# EAGLE schematic untitled (EAGLE 9.6.2)
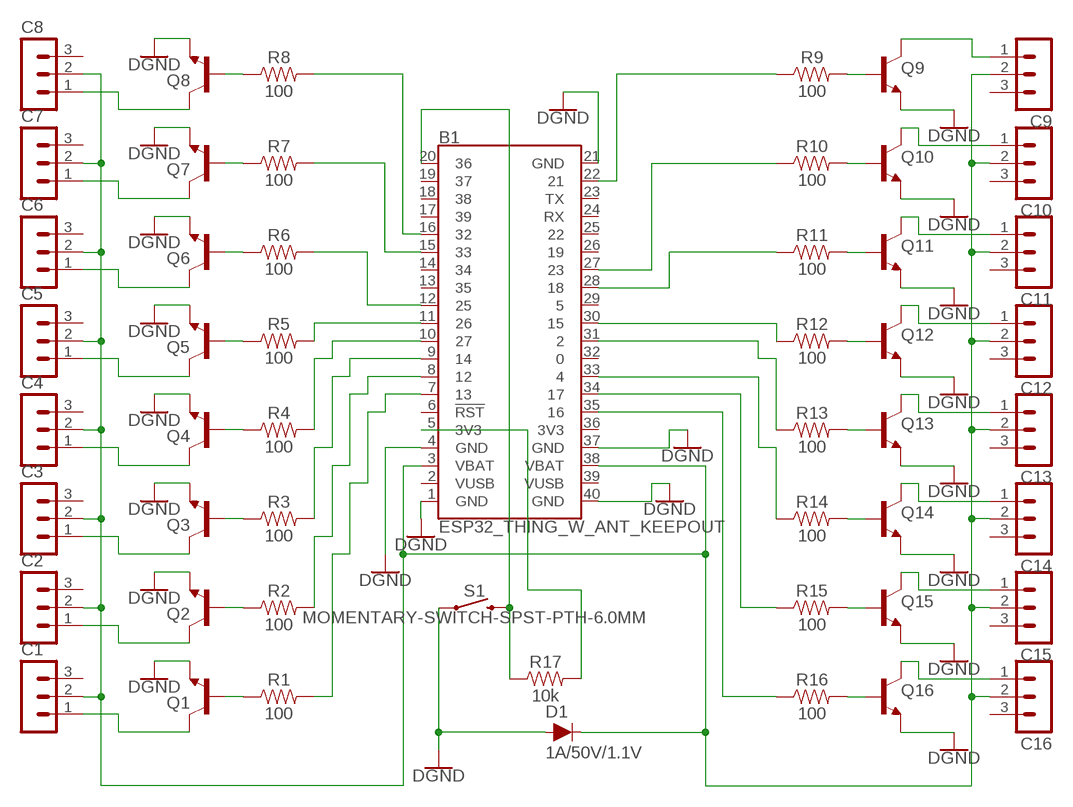
[diagram p0: schematic, sheet 1]

## Parts
B1  ESP32_THING_W_ANT_KEEPOUT  [ESP32_THING]
C1  MA03-1  [MA03-1]
C2  MA03-1  [MA03-1]
C3  MA03-1  [MA03-1]
C4  MA03-1  [MA03-1]
C5  MA03-1  [MA03-1]
C6  MA03-1  [MA03-1]
C7  MA03-1  [MA03-1]
C8  MA03-1  [MA03-1]
C9  MA03-1  [MA03-1]
C10  MA03-1  [MA03-1]
C11  MA03-1  [MA03-1]
C12  MA03-1  [MA03-1]
C13  MA03-1  [MA03-1]
C14  MA03-1  [MA03-1]
C15  MA03-1  [MA03-1]
C16  MA03-1  [MA03-1]
D1  1A/50V/1.1V  DIODE-PTH  [DIODE-1N4001]
Q1  600mA/40V  2N2222-NPN-TO92-EBC  [TO92-EBC]
Q2  600mA/40V  2N2222-NPN-TO92-EBC  [TO92-EBC]
Q3  600mA/40V  2N2222-NPN-TO92-EBC  [TO92-EBC]
Q4  600mA/40V  2N2222-NPN-TO92-EBC  [TO92-EBC]
Q5  600mA/40V  2N2222-NPN-TO92-EBC  [TO92-EBC]
Q6  600mA/40V  2N2222-NPN-TO92-EBC  [TO92-EBC]
Q7  600mA/40V  2N2222-NPN-TO92-EBC  [TO92-EBC]
Q8  600mA/40V  2N2222-NPN-TO92-EBC  [TO92-EBC]
Q9  600mA/40V  2N2222-NPN-TO92-EBC  [TO92-EBC]
Q10  600mA/40V  2N2222-NPN-TO92-EBC  [TO92-EBC]
Q11  600mA/40V  2N2222-NPN-TO92-EBC  [TO92-EBC]
Q12  600mA/40V  2N2222-NPN-TO92-EBC  [TO92-EBC]
Q13  600mA/40V  2N2222-NPN-TO92-EBC  [TO92-EBC]
Q14  600mA/40V  2N2222-NPN-TO92-EBC  [TO92-EBC]
Q15  600mA/40V  2N2222-NPN-TO92-EBC  [TO92-EBC]
Q16  600mA/40V  2N2222-NPN-TO92-EBC  [TO92-EBC]
R1  100  100OHM-VERT-1/4W-1%  [AXIAL-0.1]
R2  100  100OHM-VERT-1/4W-1%  [AXIAL-0.1]
R3  100  100OHM-VERT-1/4W-1%  [AXIAL-0.1]
R4  100  100OHM-VERT-1/4W-1%  [AXIAL-0.1]
R5  100  100OHM-VERT-1/4W-1%  [AXIAL-0.1]
R6  100  100OHM-VERT-1/4W-1%  [AXIAL-0.1]
R7  100  100OHM-VERT-1/4W-1%  [AXIAL-0.1]
R8  100  100OHM-VERT-1/4W-1%  [AXIAL-0.1]
R9  100  100OHM-VERT-1/4W-1%  [AXIAL-0.1]
R10  100  100OHM-VERT-1/4W-1%  [AXIAL-0.1]
R11  100  100OHM-VERT-1/4W-1%  [AXIAL-0.1]
R12  100  100OHM-VERT-1/4W-1%  [AXIAL-0.1]
R13  100  100OHM-VERT-1/4W-1%  [AXIAL-0.1]
R14  100  100OHM-VERT-1/4W-1%  [AXIAL-0.1]
R15  100  100OHM-VERT-1/4W-1%  [AXIAL-0.1]
R16  100  100OHM-VERT-1/4W-1%  [AXIAL-0.1]
R17  10k  10KOHM-VERT-1/4W-5%  [AXIAL-0.1]
S1  MOMENTARY-SWITCH-SPST-PTH-6.0MM  [TACTILE_SWITCH_PTH_6.0MM]

## Nets
GND: B1.1(GND) B1.4(GND) B1.21(GND) B1.37(GND) B1.40(GND) D1.A Q1.E Q2.E Q3.E Q4.E Q5.E Q6.E Q7.E Q8.E Q9.E Q10.E Q11.E Q12.E Q13.E Q14.E Q15.E Q16.E S1.1 ; supply symbol labelled DGND
N$1: B1.11 R5.P$2
N$2: B1.22 R9.P$1
N$3: Q9.B R9.P$2
N$4: B1.27 R10.P$1
N$5: B1.10 R4.P$2
N$6: B1.28 R11.P$1
N$7: B1.35 R16.P$1
N$8: B1.34 R15.P$1
N$9: B1.33 R14.P$1
N$10: Q16.B R16.P$2
N$11: Q15.B R15.P$2
N$12: Q14.B R14.P$2
N$13: Q13.B R13.P$2
N$14: Q12.B R12.P$2
N$15: Q11.B R11.P$2
N$16: Q10.B R10.P$2
N$17: B1.31 R13.P$1
N$18: B1.30 R12.P$1
N$19: Q2.B R2.P$1
N$20: Q1.B R1.P$1
N$21: Q3.B R3.P$1
N$22: Q4.B R4.P$1
N$23: Q5.B R5.P$1
N$24: Q6.B R6.P$1
N$25: Q7.B R7.P$1
N$26: Q8.B R8.P$1
N$27: C8.1 Q8.C
N$28: C7.1 Q7.C
N$29: C6.1 Q6.C
N$30: C5.1 Q5.C
N$31: C4.1 Q4.C
N$32: C3.1 Q3.C
N$33: C2.1 Q2.C
N$34: C1.1 Q1.C
N$35: C16.1 Q16.C
N$36: C15.1 Q15.C
N$37: C14.1 Q14.C
N$38: C13.1 Q13.C
N$39: C12.1 Q12.C
N$40: C11.1 Q11.C
N$41: C10.1 Q10.C
N$42: C9.1 Q9.C
N$43: B1.3(VBAT) B1.38(VBAT) C1.2 C2.2 C3.2 C4.2 C5.2 C6.2 C7.2 C8.2 C9.2 C10.2 C11.2 C12.2 C13.2 C14.2 C15.2 C16.2 D1.C
N$44: B1.20 R17.P$1 S1.3
N$45: B1.9 R3.P$2
N$46: B1.16 R8.P$2
N$47: B1.15 R7.P$2
N$48: B1.12 R6.P$2
N$49: B1.8 R2.P$2
N$50: B1.7 R1.P$2
N$51: B1.5(3V3) R17.P$2
Unconnected: B1.2(VUSB) B1.6(!RST!) B1.13 B1.14 B1.17 B1.18 B1.19 B1.23(TX) B1.24(RX) B1.25 B1.26 B1.29 B1.32 B1.36(3V3) B1.39(VUSB) C1.3 C2.3 C3.3 C4.3 C5.3 C6.3 C7.3 C8.3 C9.3 C10.3 C11.3 C12.3 C13.3 C14.3 C15.3 C16.3

## Library data of the parts
B1 = SparkFun-Boards:ESP32_THING: SparkFun ESP32 Thing Board Pins, silkscreen, and logos matching the layout of the SparkFun ESP32 Thing <https://www.sparkfun.com/products/13907> Dimensions: 2.32" x 1.00"; SF_ID: DEV-13907
C1-C16 = con-lstb:MA03-1: PIN HEADER; OC_FARNELL: unknown; OC_NEWARK: unknown
D1 = SparkFun-DiscreteSemi:DIODE: Diode These are standard reverse protection diodes and small signal diodes. SparkFun Products: SparkFun SparkPunk Sound Kit <https://www.sparkfun.com/products/11177> SparkFun ESP8266 Thing <https://www.sparkfun.com/products/13231>; PROD_ID: DIO-09176
Q1-Q16 = transistor-neu-to92:*-NPN-: NPN Transistror
R1-R16 = SparkFun-Resistors:100OHM: 100Ω resistor A resistor is a passive two-terminal electrical component that implements electrical resistance as a circuit element. Resistors act to reduce current flow, and, at the same time, act to lower voltage levels within circuits. - Wikipedia; PROD_ID: RES-12181
R17 = SparkFun-Resistors:10KOHM: 10kΩ resistor A resistor is a passive two-terminal electrical component that implements electrical resistance as a circuit element. Resistors act to reduce current flow, and, at the same time, act to lower voltage levels within circuits. - Wikipedia; PROD_ID: RES-09435
S1 = SparkFun-Switches:MOMENTARY-SWITCH-SPST: Momentary Switch (Pushbutton) - SPST Normally-open (NO) SPST momentary switches (buttons, pushbuttons). Variants PTH-12MM - 12mm square, through-hole Momentary Pushbutton Switch - 12mm Square <https://www.sparkfun.com/products/9190> (COM-09190) PTH-6.0MM, PTH-6.0MM-KIT - 6.0mm square, through-hole Mini Pushbutton Switch <https://www.sparkfun.com/products/97> (COM-00097) KIT package intended for soldering kit's - only one side of pads' copper is exposed. PTH-RIGHT-ANGLE-KIT - Right-angle, through-hole Right Angle Tactile Button <https://www.sparkfun.com/products/10791> - Used on SparkFun BigTime Watch Kit <https://www.sparkfun.com/products/11734> SMD-12MM - 12mm square, surface-mount Tactile Button - SMD (12mm) <https://www.sparkfun.com/products/12993> (COM-12993) Used on SparkFun PicoBoard <https://www.sparkfun.com/products/11888> SMD-4.5MM - 4.5mm Square Trackball Switch Used on SparkFun Blackberry Trackballer Breakout <https://www.sparkfun.com/products/13169> SMD-4.6MMX2.8MM - 4.60mm x 2.80mm, surface mount Used on SparkFun SAMD21 Mini Breakout <https://www.sparkfun.com/products/13664> SMD-5.2MM, SMD-5.2-REDUNDANT - 5.2mm square, surface-mount Mini Pushbutton Switch - SMD <https://www.sparkfun.com/products/8720> (COM-08720) Used on Arduino Pro Mini <https://www.sparkfun.com/products/11114> REDUNDANT package connects both switch circuits together SMD-6.0X3.5MM - 6.0 x 3.5mm, surface mount Momentary Reset Switch SMD <https://www.sparkfun.com/products/8229> (COM-08229) SMD-6.2MM-TALL - 6.2mm square, surface mount Tactile Button - SMD (6mm) <https://www.sparkfun.com/products/12992> Used on SparkFun Digital Sandbox <https://www.sparkfun.com/products/12651> SMD-RIGHT-ANGLE - Right-angle, surface mount Used on SparkFun Block for Intel® Edison - Arduino <https://www.sparkfun.com/products/13036>; PROD_ID: SWCH-08441; SF_SKU: COM-00097